# Altium project FPGA3.PrjPCB (part 2 of 2)
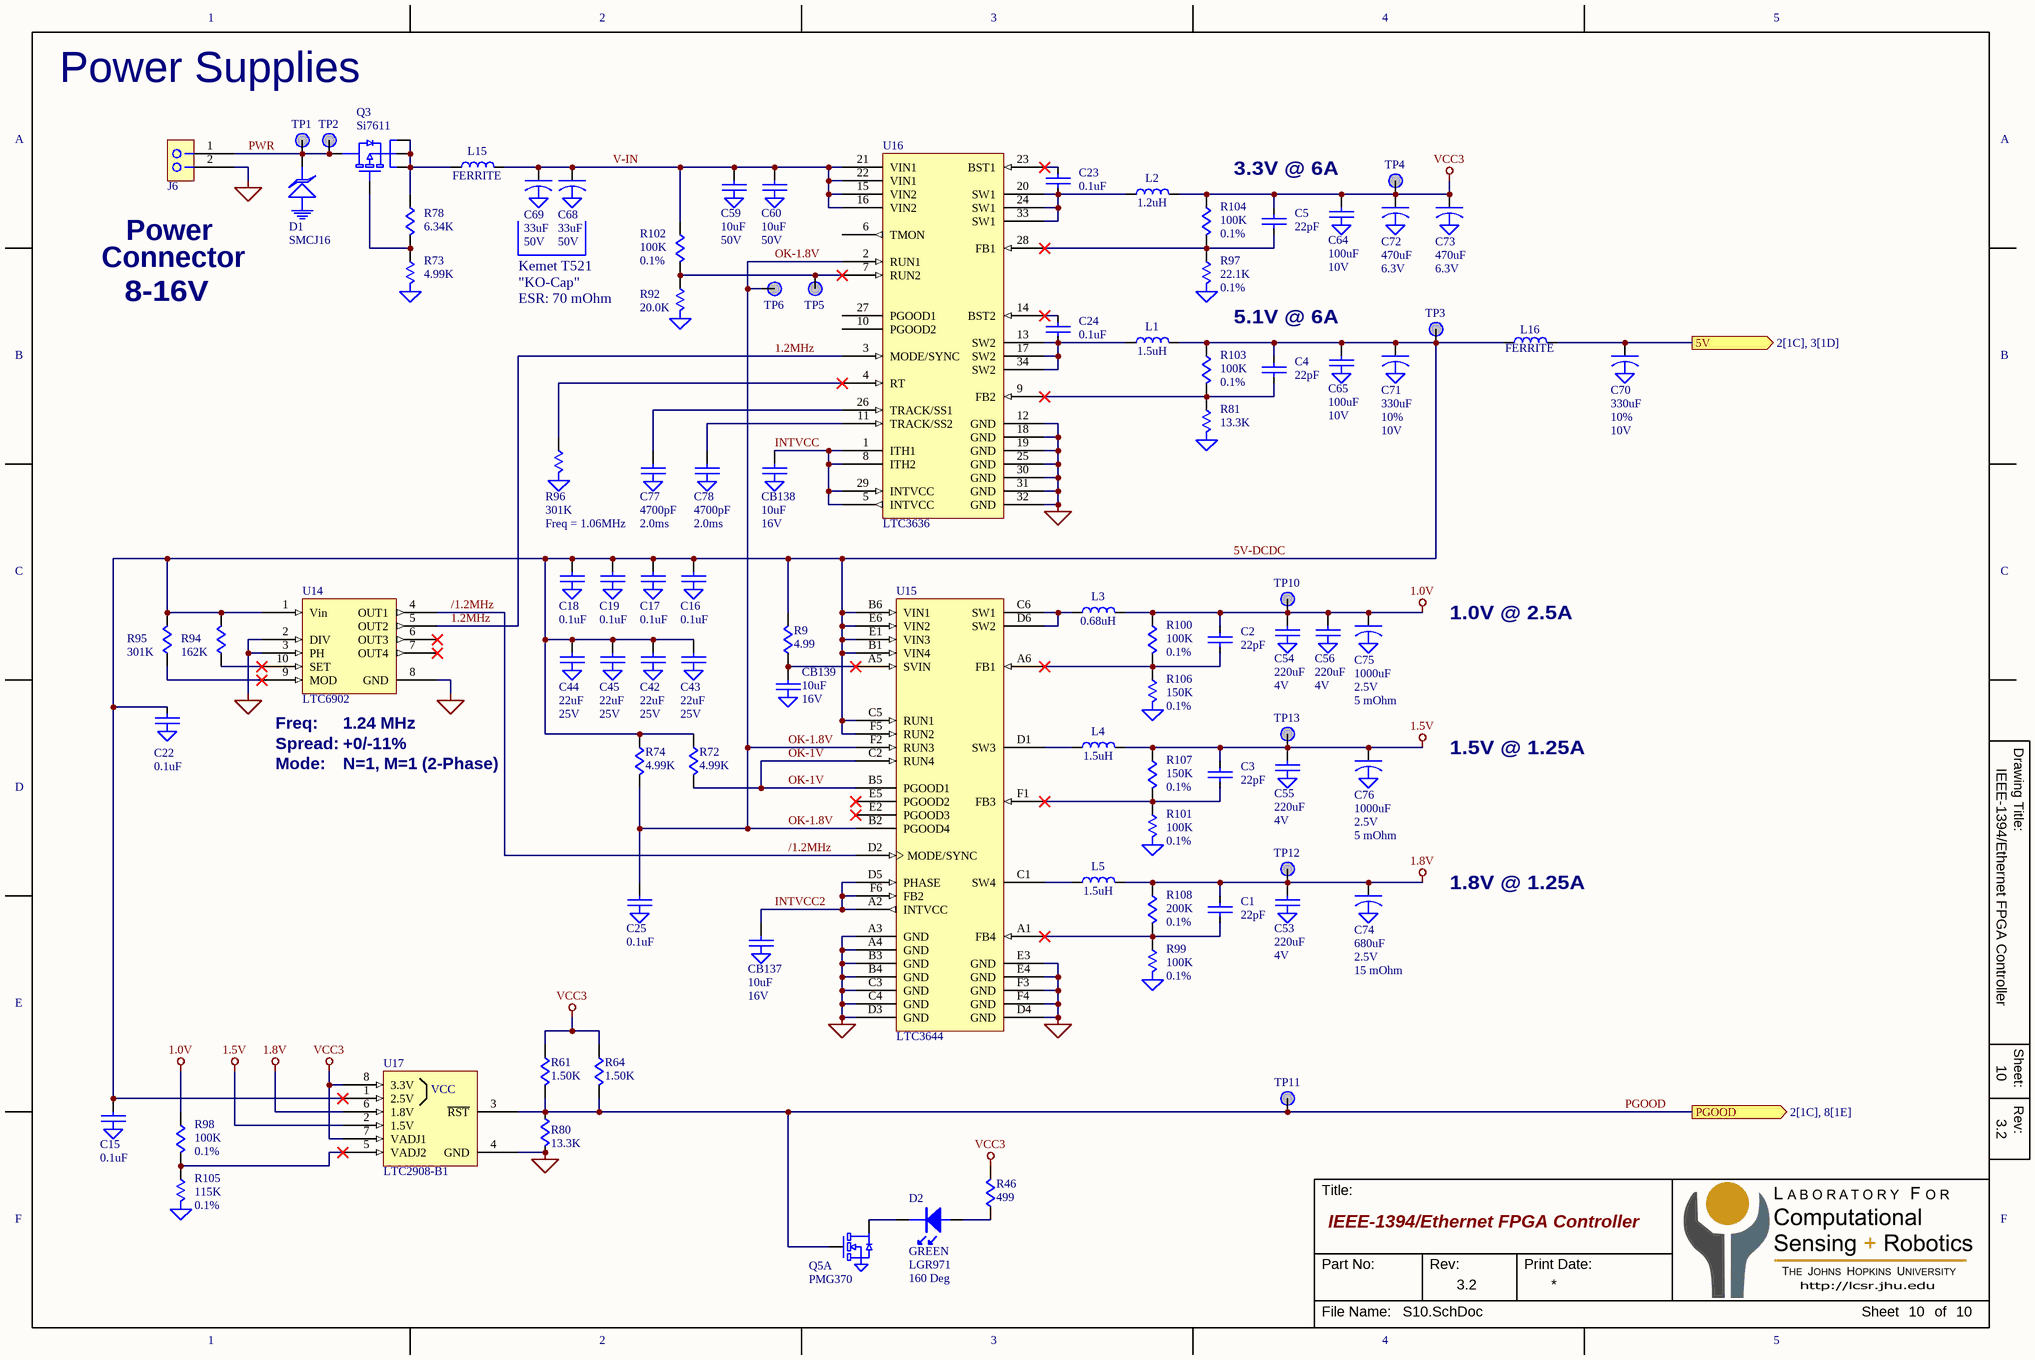
[diagram p10: S10.SchDoc]

## Nets that join several sheets
1.0V: S09 (31 pins), S10 (8 pins)
1.5V: S07 (76 pins), S09 (16 pins), S10 (7 pins)
1.8V: S05 (7 pins), S09 (29 pins), S10 (7 pins)
GND: S01 (M1.1 M2.1 M3.1 M4.1), S02 (17 pins), S03 (56 pins), S04 (Q4.4 R60A.2 SW1.2 SW1.5), S05 (22 pins), S06 (11 pins), S07 (117 pins), S08 (24 pins), S09 (146 pins), S10 (69 pins)
VCC3: S02 (R117.1 U12.6), S03 (26 pins), S04 (R48.2 R60.2), S05 (9 pins), S06 (5 pins), S07 (C20.1 U18.2 U18.6), S08 (16 pins), S09 (46 pins), S10 (12 pins)
5V: S02 (R118.1 U13.6), S03 (R57.1), S10 (C70.1 L16.2)
/SD-CD: S06 (J5.11 R53.1 U1.D16), S08 (Q5.5)
e1-/IRQ: S04 (U1.R16), S05 (U10.31)
e1-/RESET: S04 (U1.P20), S05 (R58.1 U10.12)
e1-MDIO-C: S04 (U1.R19), S05 (U9.3)
e1-MDIO-D: S04 (U1.T20), S05 (U8.4)
e2-/IRQ: S04 (U1.U14), S05 (U11.31)
e2-/RESET: S04 (U1.N20), S05 (R59.1 U11.12)
e2-MDIO-C: S04 (U1.P19), S05 (U9.1)
FW-/RST: S03 (R83.1 U5.53), S04 (U1.D20)
FW-CLK: S03 (U5.2), S04 (U1.H16)
FW-CTL0: S03 (U5.4), S04 (U1.F20)
FW-CTL1: S03 (U5.5), S04 (U1.F19)
FW-D0: S03 (U5.6), S04 (U1.L17)
FW-D1: S03 (U5.7), S04 (U1.J16)
FW-D2: S03 (U5.8), S04 (U1.E18)
FW-D3: S03 (U5.9), S04 (U1.E17)
FW-D4: S03 (U5.10), S04 (U1.H17)
FW-D5: S03 (U5.11), S04 (U1.G19)
FW-D6: S03 (U5.12), S04 (U1.D19)
FW-D7: S03 (U5.13), S04 (U1.D18)
FW-LREQ: S03 (U5.1), S04 (U1.M18)
IO1-0: S02 (J1.1), S04 (U1.N18)
IO1-1: S02 (J1.3), S04 (U1.M20)
IO1-2: S02 (J1.4), S04 (U1.M19)
IO1-3: S02 (J1.5), S04 (U1.L20)
IO1-4: S02 (J1.6), S04 (U1.L19)
IO1-5: S02 (J1.7), S04 (U1.K19)
IO1-6: S02 (J1.8), S04 (U1.K18)
IO1-7: S02 (J1.9), S04 (U1.J19)
IO1-8: S02 (J1.10), S04 (U1.J20)
IO1-9: S02 (J1.11), S04 (U1.G20)
IO1-10: S02 (J1.12), S04 (U1.H20)
IO1-11: S02 (J1.13), S04 (U1.E19)
IO1-12: S02 (J1.15), S04 (U1.N15)
IO1-13: S02 (J1.16), S04 (U1.M15)
IO1-14: S02 (J1.17), S04 (U1.M17)
IO1-15: S02 (J1.18), S04 (U1.L16)
IO1-16: S02 (J1.19), S04 (U1.L15)
IO1-17: S02 (J1.20), S04 (U1.K14)
IO1-18: S02 (J1.21), S04 (U1.K16)
IO1-19: S02 (J1.22), S04 (U1.K17)
IO1-20: S02 (J1.23), S04 (U1.J18)
IO1-21: S02 (J1.24), S04 (U1.J15)
IO1-22: S02 (J1.25), S04 (U1.H18)
IO1-23: S02 (J1.27), S04 (U1.G18)
IO1-24: S02 (J1.28), S04 (U1.H15)
IO1-25: S02 (J1.29), S04 (U1.G17)
IO1-26: S02 (J1.30), S04 (U1.F17)
IO1-27: S02 (J1.31), S04 (U1.G15)
IO1-28: S02 (J1.32), S04 (U1.F16)
IO1-29: S02 (J1.33), S04 (U1.J14)
IO1-30: S02 (J1.34), S04 (U1.G14)
IO1-31: S02 (J1.35), S04 (U1.M14)
IO1-32: S02 (J1.36), S04 (U1.L14)
IO1-33: S02 (J1.43), S04 (U1.N17)
IO2-0: S02 (J2.2), S04 (U1.T16)
IO2-1: S02 (J2.3), S04 (U1.P16)
IO2-2: S02 (J2.4), S04 (U1.P18)
IO2-3: S02 (J2.5), S04 (U1.R17)
IO2-4: S02 (J2.6), S04 (U1.R18)
IO2-5: S02 (J2.7), S04 (U1.T19)
IO2-6: S02 (J2.8), S04 (U1.U18)
IO2-7: S02 (J2.9), S04 (U1.U19)
IO2-8: S02 (J2.10), S04 (U1.U20)
IO2-9: S02 (J2.11), S04 (U1.W20)
IO2-10: S02 (J2.12), S04 (U1.V20)
IO2-11: S02 (J2.13), S04 (U1.V18)
IO2-12: S02 (J2.14), S04 (U1.W19)
IO2-13: S02 (J2.16), S04 (U1.T17)
IO2-14: S02 (J2.17), S04 (U1.W16)
IO2-15: S02 (J2.18), S04 (U1.V17)
IO2-16: S02 (J2.19), S04 (U1.W15)
IO2-17: S02 (J2.20), S04 (U1.V16)
IO2-18: S02 (J2.21), S04 (U1.T15)
IO2-19: S02 (J2.22), S04 (U1.V15)
IO2-20: S02 (J2.23), S04 (U1.P14)
IO2-21: S02 (J2.24), S04 (U1.R14)
IO2-22: S02 (J2.25), S04 (U1.W18)
IO2-23: S02 (J2.26), S04 (U1.Y19)
IO2-24: S02 (J2.27), S04 (U1.Y18)
IO2-25: S02 (J2.28), S04 (U1.Y16)
IO2-26: S02 (J2.30), S04 (U1.Y17)
IO2-27: S02 (J2.31), S04 (U1.U15)
IO2-28: S02 (J2.32), S04 (U1.Y14)
IO2-29: S02 (J2.33), S04 (U1.T14)
IO2-30: S02 (J2.34), S04 (U1.W14)
IO2-31: S02 (J2.35), S04 (U1.P15)
IO2-32: S02 (J2.36), S04 (U1.W13)
IO2-33: S02 (J2.37), S04 (U1.V13)
IO2-34: S02 (J2.38), S04 (U1.V12)
IO2-35: S02 (J2.39), S04 (U1.U12)
IO2-36: S02 (J2.40), S04 (U1.T11)
IO2-37: S02 (J2.41), S04 (U1.T10)
IO2-38: S02 (J2.42), S04 (U1.T12)
IO2-39: S02 (J2.44), S04 (U1.U17)
MIO34: S02 (J9.3), S06 (U1.A12)
MIO35: S02 (J9.4), S06 (U1.F12)
MIO36: S02 (J9.5), S06 (U1.A11)
MIO37: S02 (J9.6), S06 (U1.A10)
PGOOD: S02 (U12.3 U13.3), S08 (U1.C7 U20.1), S10 (6 pins)